# EAGLE design Window_Controller (EAGLE 9.1.3)
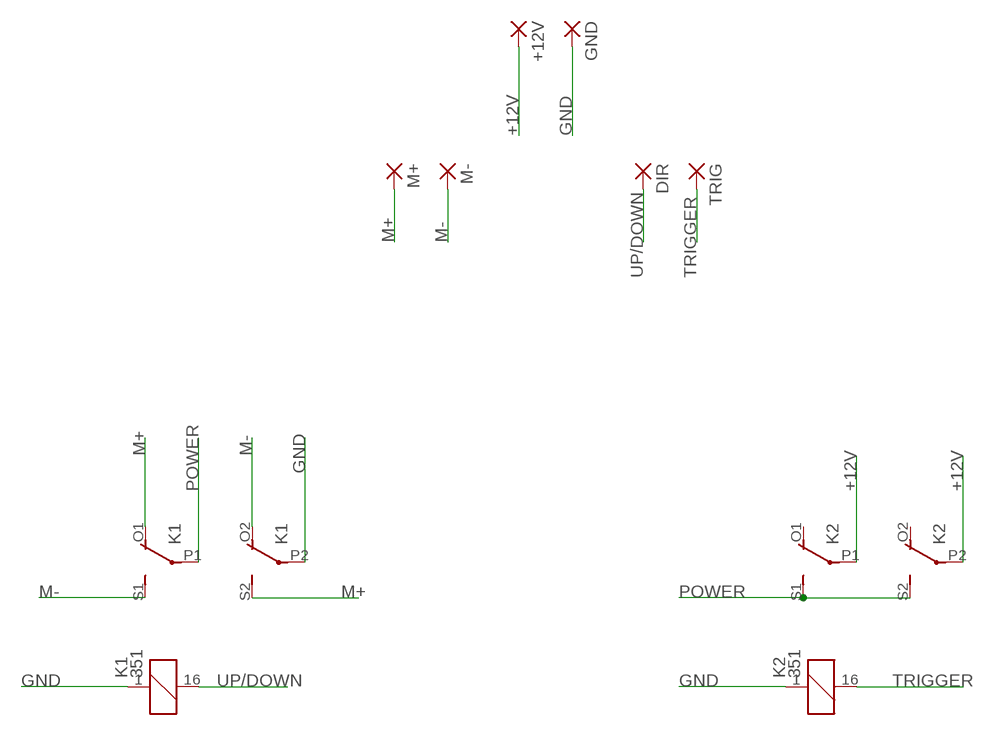
[diagram p0: schematic, sheet 1]

## Parts
+12V  3,81/1,4  [3,81/1,4]
DIR  3,81/1,4  [3,81/1,4]
GND  3,81/1,4  [3,81/1,4]
K1  351  [351]
K2  351  [351]
M+  3,81/1,4  [3,81/1,4]
M-  3,81/1,4  [3,81/1,4]
TRIG  3,81/1,4  [3,81/1,4]

## Nets
+12V: +12V.1(P) K2.P1(2:P) K2.P2(3:P)
GND: GND.1(P) K1.1 K1.P2(3:P) K2.1
M+: K1.O1(2:O) K1.S2(3:S) M+.1(P)
M-: K1.O2(3:O) K1.S1(2:S) M-.1(P)
POWER: K1.P1(2:P) K2.S1(2:S) K2.S2(3:S)
TRIGGER: K2.16 TRIG.1(P)
UP/DOWN: DIR.1(P) K1.16
Unconnected: K2.O1(2:O) K2.O2(3:O)

## Library data of the parts
+12V DIR GND M+ M- TRIG = wirepad:3,81/1,4: THROUGH-HOLE PAD
K1 K2 = relay:351: RELAY 2 x switch, Omron; OC_FARNELL: unknown; OC_NEWARK: unknown

## Board
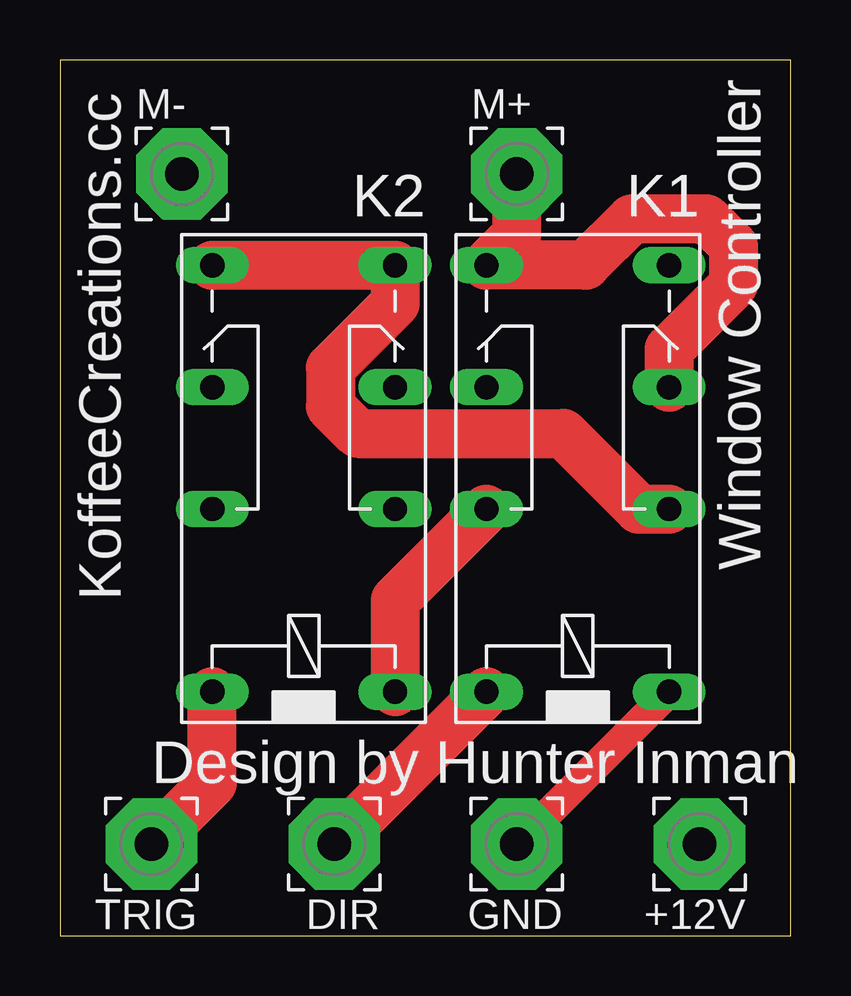
[diagram p1: board, top side]
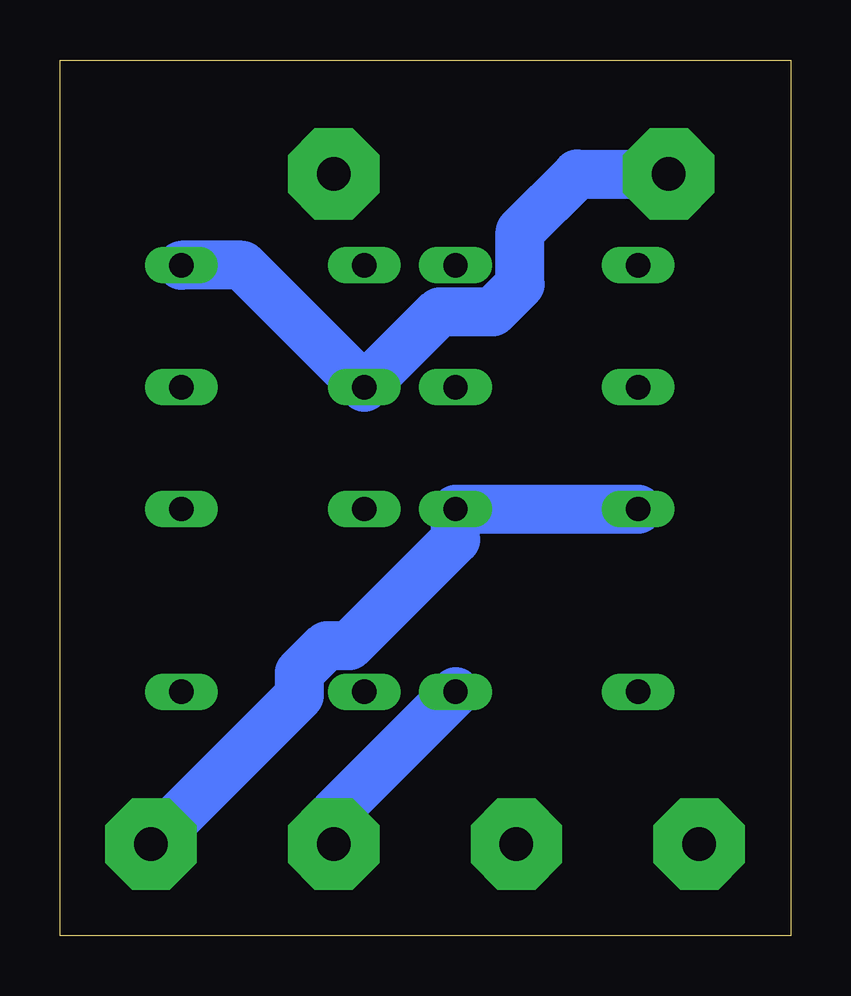
[diagram p2: board, bottom side, seen from below]

Size 30.46 x 36.5 mm. Coordinates in mm from the lower left corner, seen from the top.
Outline: 0,0 30.46,0 30.46,36.5 0,36.5 0,0
Copper layers (1*16): Top 0.035mm / dielectric 1.5mm / Bottom 0.035mm
Design rules "default *": minimum track width 36mil, minimum drill 0.35mm, track to track 6mil, track to pad 6mil, pad to pad 6mil, via to via 6mil, smd to smd 6mil, copper to edge 40mil, drill to drill 6mil, minimum pad ring 10mil, minimum via ring 8mil, stop-mask expansion 4mil, vias tented up to drill 0mil, thermal gap 10mil

### Footprints (pad centres in the part's own frame; a part is rotated, then mirrored left to right if it is on the bottom)
3,81/1,4 = drill 1.397 pad 3.81 octagon: 1 0,0
351 = drill 1.016 long: 1 -3.81,-3.81; 16 -3.81,3.81; O1 8.89,-3.81; O2 8.89,3.81; P1 3.81,-3.81; P2 3.81,3.81; S1 13.97,-3.81; S2 13.97,3.81

### Placement (x,y rotation side)
+12V  26.67,3.81 180 top
DIR  11.43,3.81 180 top
GND  19.05,3.81 180 top
K1  21.59,13.97 90 top
K2  10.16,13.97 90 top
M+  19.05,31.75 0 top
M-  5.08,31.75 0 top
TRIG  3.81,3.81 180 top

### Tracks (layer width: path | path; a pad name or v marks a point on that pad's centre or on a via)
+12V
  Bottom 1.27: 26.67,2.54 +12V.1
  Bottom 2.032: +12V.1 20.47,10.01 20.47,10.96 19.34,12.09 18.39,12.09 13.97,16.51 K2.P1 K2.P2
GND
  Top 1.27: K1.1 GND.1
  Top 2.032: K1.P2 13.97,13.97 K2.1
  Bottom 2.032: K2.1 19.05,5.08 GND.1
M+
  Top 2.032: K1.O1 25.4,24.45 28.09,27.14 28.09,28.74 26.96,29.87 23.84,29.87 21.91,27.94 K1.S2 19.05,29.21 M+.1
M-
  Bottom 2.032: M-.1 8.89,31.75 11.28,29.36 11.28,27.14 12.41,26.01 14.63,26.01 K1.O2 22.86,27.94 K1.S1
POWER
  Top 2.032: K2.S2 K2.S1 13.97,26.35 11.28,23.66 11.28,22.06 12.41,20.93 20.98,20.93 24.13,17.78 K1.P1
TRIGGER
  Top 2.032: TRIG.1 6.35,6.35 K2.16
UP/DOWN
  Top 2.032: DIR.1 K1.16

### Text on the board
tNames: Window Controller | KoffeeCreations.cc | Design by Hunter Inman